# Altium schematic sheet main.SchDoc
size A4; SheetNumber: 1; SheetTotal: 9
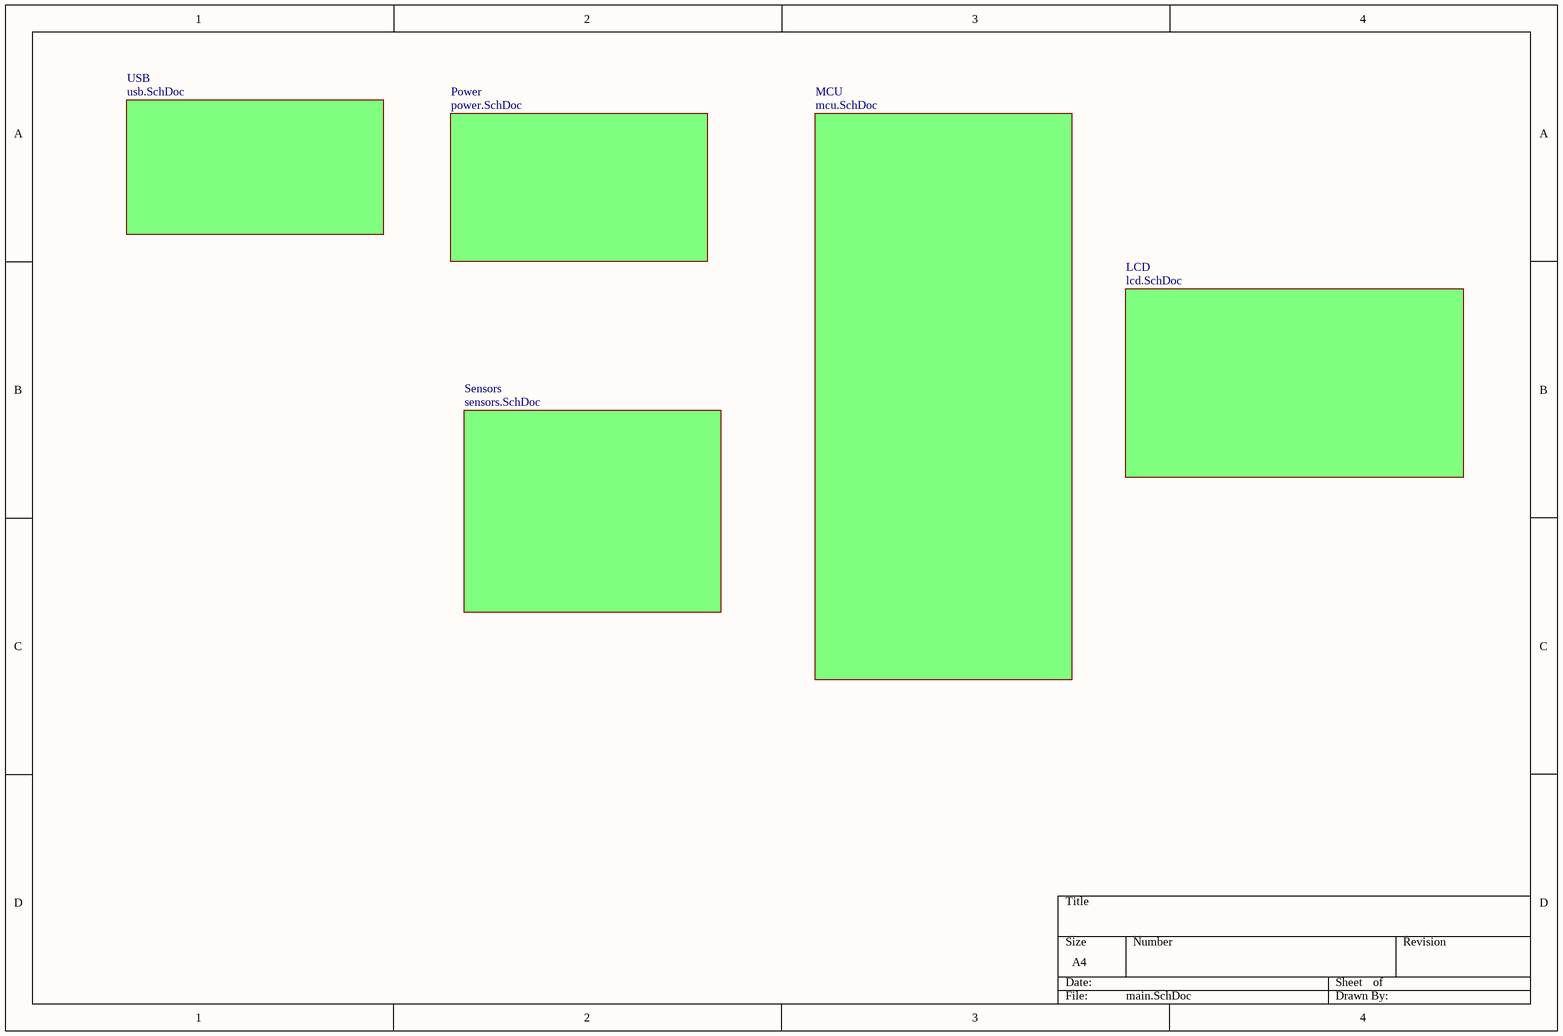
[diagram p0: main.SchDoc]

## Sub-sheets
LCD = lcd.SchDoc: no entries
MCU = mcu.SchDoc: no entries
Power = power.SchDoc: no entries
Sensors = sensors.SchDoc: no entries
USB = usb.SchDoc: no entries